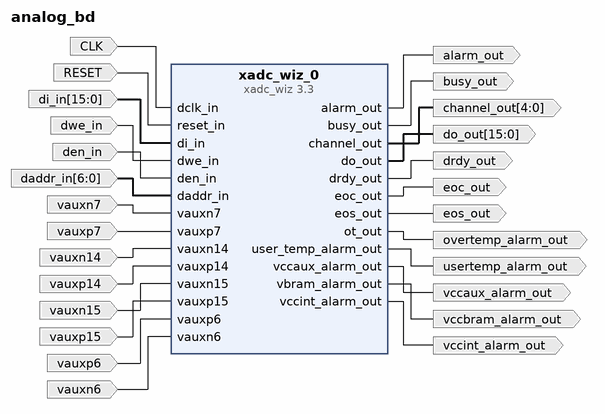
[diagram p0: block diagram of the top level]
# Vivado block design analog_bd, xc7a35tcpg236-1, Vivado 2017.1
create_bd_design analog_bd

create_bd_port -dir I CLK
create_bd_port -dir I RESET
create_bd_port -dir O -from 15 -to 0 do_out
create_bd_port -dir O drdy_out
create_bd_port -dir I -from 15 -to 0 di_in
create_bd_port -dir I dwe_in
create_bd_port -dir I den_in
create_bd_port -dir I -from 6 -to 0 daddr_in
create_bd_port -dir O usertemp_alarm_out
create_bd_port -dir O vccint_alarm_out
create_bd_port -dir O vccaux_alarm_out
create_bd_port -dir O overtemp_alarm_out
create_bd_port -dir O -from 4 -to 0 channel_out
create_bd_port -dir O eoc_out
create_bd_port -dir O vccbram_alarm_out
create_bd_port -dir O alarm_out
create_bd_port -dir O eos_out
create_bd_port -dir O busy_out
create_bd_port -dir I vauxn7
create_bd_port -dir I vauxp7
create_bd_port -dir I vauxn14
create_bd_port -dir I vauxp14
create_bd_port -dir I vauxn15
create_bd_port -dir I vauxp15
create_bd_port -dir I vauxn6
create_bd_port -dir I vauxp6

create_bd_cell -type ip -vlnv xilinx.com:ip:xadc_wiz:3.3 xadc_wiz_0
set_property -dict [list \
  CONFIG.INTERFACE_SELECTION ENABLE_DRP \
  CONFIG.TIMING_MODE Continuous \
  CONFIG.XADC_STARUP_SELECTION channel_sequencer \
  CONFIG.ENABLE_DCLK true \
  CONFIG.SEQUENCER_MODE Continuous \
  CONFIG.ENABLE_CALIBRATION_AVERAGING true \
  CONFIG.ENABLE_DRP false \
  CONFIG.ENABLE_RESET true \
  CONFIG.OT_ALARM true \
  CONFIG.USER_TEMP_ALARM true \
  CONFIG.VCCINT_ALARM true \
  CONFIG.VCCAUX_ALARM true \
  CONFIG.ENABLE_VBRAM_ALARM true \
  CONFIG.TEMPERATURE_ALARM_OT_TRIGGER 100.0 \
  CONFIG.TEMPERATURE_ALARM_OT_RESET 60.0 \
  CONFIG.SINGLE_CHANNEL_SELECTION TEMPERATURE \
  CONFIG.CHANNEL_AVERAGING 16 \
  CONFIG.ADC_OFFSET_AND_GAIN_CALIBRATION true \
  CONFIG.SENSOR_OFFSET_CALIBRATION false \
  CONFIG.SENSOR_OFFSET_AND_GAIN_CALIBRATION true \
  CONFIG.EXTERNAL_MUX_CHANNEL VP_VN \
  CONFIG.CHANNEL_ENABLE_TEMPERATURE false \
  CONFIG.CHANNEL_ENABLE_VCCINT false \
  CONFIG.CHANNEL_ENABLE_VCCAUX false \
  CONFIG.CHANNEL_ENABLE_VP_VN false \
  CONFIG.CHANNEL_ENABLE_VAUXP4_VAUXN4 false \
  CONFIG.CHANNEL_ENABLE_VAUXP5_VAUXN5 false \
  CONFIG.CHANNEL_ENABLE_VAUXP6_VAUXN6 true \
  CONFIG.CHANNEL_ENABLE_VAUXP7_VAUXN7 true \
  CONFIG.CHANNEL_ENABLE_VAUXP8_VAUXN8 false \
  CONFIG.CHANNEL_ENABLE_VAUXP9_VAUXN9 false \
  CONFIG.CHANNEL_ENABLE_VAUXP10_VAUXN10 false \
  CONFIG.CHANNEL_ENABLE_VAUXP11_VAUXN11 false \
  CONFIG.CHANNEL_ENABLE_VAUXP12_VAUXN12 false \
  CONFIG.CHANNEL_ENABLE_VAUXP13_VAUXN13 false \
  CONFIG.CHANNEL_ENABLE_VAUXP14_VAUXN14 true \
  CONFIG.CHANNEL_ENABLE_VAUXP15_VAUXN15 true \
  CONFIG.AVERAGE_ENABLE_VAUXP4_VAUXN4 false \
  CONFIG.AVERAGE_ENABLE_VAUXP5_VAUXN5 false \
  CONFIG.AVERAGE_ENABLE_VAUXP6_VAUXN6 false \
  CONFIG.AVERAGE_ENABLE_VAUXP7_VAUXN7 false \
  CONFIG.AVERAGE_ENABLE_VAUXP12_VAUXN12 false \
  CONFIG.ACQUISITION_TIME_VAUXP4_VAUXN4 false \
  CONFIG.POWER_DOWN_ADCB false \
] [get_bd_cells xadc_wiz_0]

# ---- connections ----

connect_bd_net -net dclk_in_1 [get_bd_ports CLK] [get_bd_pins xadc_wiz_0/dclk_in]
connect_bd_net -net reset_in_1 [get_bd_ports RESET] [get_bd_pins xadc_wiz_0/reset_in]
connect_bd_net [get_bd_pins xadc_wiz_0/do_out] [get_bd_ports do_out]
connect_bd_net [get_bd_pins xadc_wiz_0/drdy_out] [get_bd_ports drdy_out]
connect_bd_net [get_bd_ports di_in] [get_bd_pins xadc_wiz_0/di_in]
connect_bd_net [get_bd_ports dwe_in] [get_bd_pins xadc_wiz_0/dwe_in]
connect_bd_net [get_bd_ports den_in] [get_bd_pins xadc_wiz_0/den_in]
connect_bd_net [get_bd_ports daddr_in] [get_bd_pins xadc_wiz_0/daddr_in]
connect_bd_net [get_bd_pins xadc_wiz_0/user_temp_alarm_out] [get_bd_ports usertemp_alarm_out]
connect_bd_net [get_bd_pins xadc_wiz_0/vccint_alarm_out] [get_bd_ports vccint_alarm_out]
connect_bd_net [get_bd_pins xadc_wiz_0/vccaux_alarm_out] [get_bd_ports vccaux_alarm_out]
connect_bd_net [get_bd_pins xadc_wiz_0/ot_out] [get_bd_ports overtemp_alarm_out]
connect_bd_net [get_bd_pins xadc_wiz_0/channel_out] [get_bd_ports channel_out]
connect_bd_net [get_bd_pins xadc_wiz_0/eoc_out] [get_bd_ports eoc_out]
connect_bd_net [get_bd_pins xadc_wiz_0/vbram_alarm_out] [get_bd_ports vccbram_alarm_out]
connect_bd_net [get_bd_pins xadc_wiz_0/alarm_out] [get_bd_ports alarm_out]
connect_bd_net [get_bd_pins xadc_wiz_0/eos_out] [get_bd_ports eos_out]
connect_bd_net [get_bd_pins xadc_wiz_0/busy_out] [get_bd_ports busy_out]
connect_bd_net -net vauxn7_1 [get_bd_ports vauxn7] [get_bd_pins xadc_wiz_0/vauxn7]
connect_bd_net -net vauxp7_1 [get_bd_ports vauxp7] [get_bd_pins xadc_wiz_0/vauxp7]
connect_bd_net -net vauxn14_1 [get_bd_ports vauxn14] [get_bd_pins xadc_wiz_0/vauxn14]
connect_bd_net -net vauxp14_1 [get_bd_ports vauxp14] [get_bd_pins xadc_wiz_0/vauxp14]
connect_bd_net -net vauxn15_1 [get_bd_ports vauxn15] [get_bd_pins xadc_wiz_0/vauxn15]
connect_bd_net -net vauxp15_1 [get_bd_ports vauxp15] [get_bd_pins xadc_wiz_0/vauxp15]
connect_bd_net -net vauxp6_1 [get_bd_ports vauxp6] [get_bd_pins xadc_wiz_0/vauxp6]
connect_bd_net -net vauxn6_1 [get_bd_ports vauxn6] [get_bd_pins xadc_wiz_0/vauxn6]

validate_bd_design
save_bd_design
